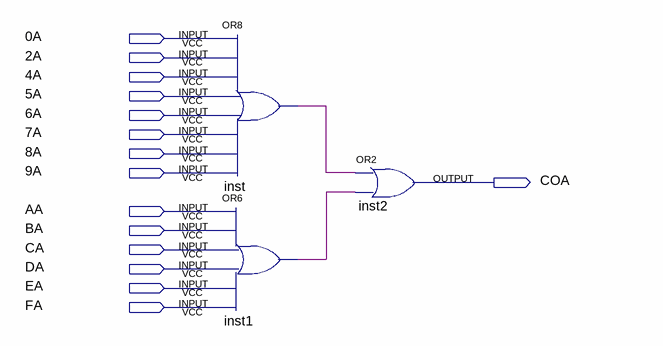
[diagram p0: schematic sheet]
// Quartus schematic COLUNA_A.bdf as structural Verilog: 3 symbols, 15 pins
module COLUNA_A (
  input  \0A ,
  input  \2A ,
  input  \4A ,
  input  \5A ,
  input  \6A ,
  input  \7A ,
  input  \8A ,
  input  \9A ,
  input  AA,
  input  BA,
  input  CA,
  input  DA,
  input  EA,
  input  FA,
  output COA
);

  wire inst1_out, inst_out;

  or inst (inst_out, \0A , \2A , \4A , \5A , \6A , \7A , \8A , \9A );
  or inst1 (inst1_out, AA, BA, CA, DA, EA, FA);
  or inst2 (COA, inst_out, inst1_out);
endmodule
